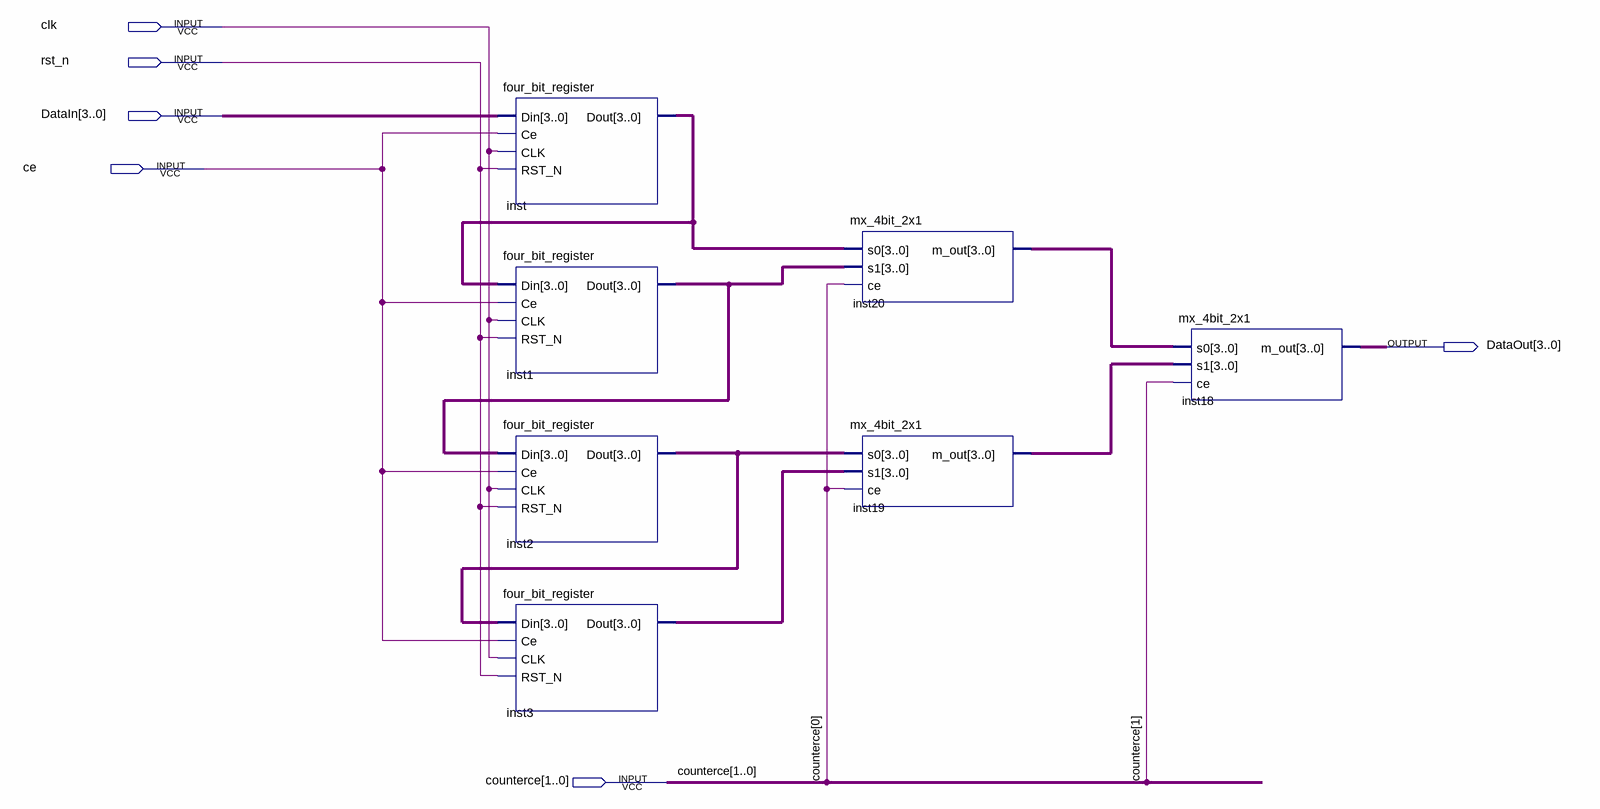
[diagram p0: schematic sheet]
// Quartus schematic fourbit_reg_sram.bdf as structural Verilog: 7 symbols, 6 pins
module fourbit_reg_sram (
  input  clk,
  input  rst_n,
  input  [3:0] DataIn,
  input  ce,
  input  [1:0] counterce,
  output [3:0] DataOut
);

  wire [3:0] inst1_dout, inst2_dout, inst3_dout, inst19_m_out, inst20_m_out, inst_dout;

  four_bit_register inst (.Din(DataIn), .Ce(ce), .CLK(clk), .RST_N(rst_n), .Dout(inst_dout));
  four_bit_register inst1 (.Din(inst_dout), .Ce(ce), .CLK(clk), .RST_N(rst_n), .Dout(inst1_dout));
  four_bit_register inst2 (.Din(inst1_dout), .Ce(ce), .CLK(clk), .RST_N(rst_n), .Dout(inst2_dout));
  four_bit_register inst3 (.Din(inst2_dout), .Ce(ce), .CLK(clk), .RST_N(rst_n), .Dout(inst3_dout));
  mx_4bit_2x1 inst20 (.s0(inst_dout), .s1(inst1_dout), .ce(counterce[0]), .m_out(inst20_m_out));
  mx_4bit_2x1 inst19 (.s0(inst2_dout), .s1(inst3_dout), .ce(counterce[0]), .m_out(inst19_m_out));
  mx_4bit_2x1 inst18 (.s0(inst20_m_out), .s1(inst19_m_out), .ce(counterce[1]), .m_out(DataOut));
endmodule
